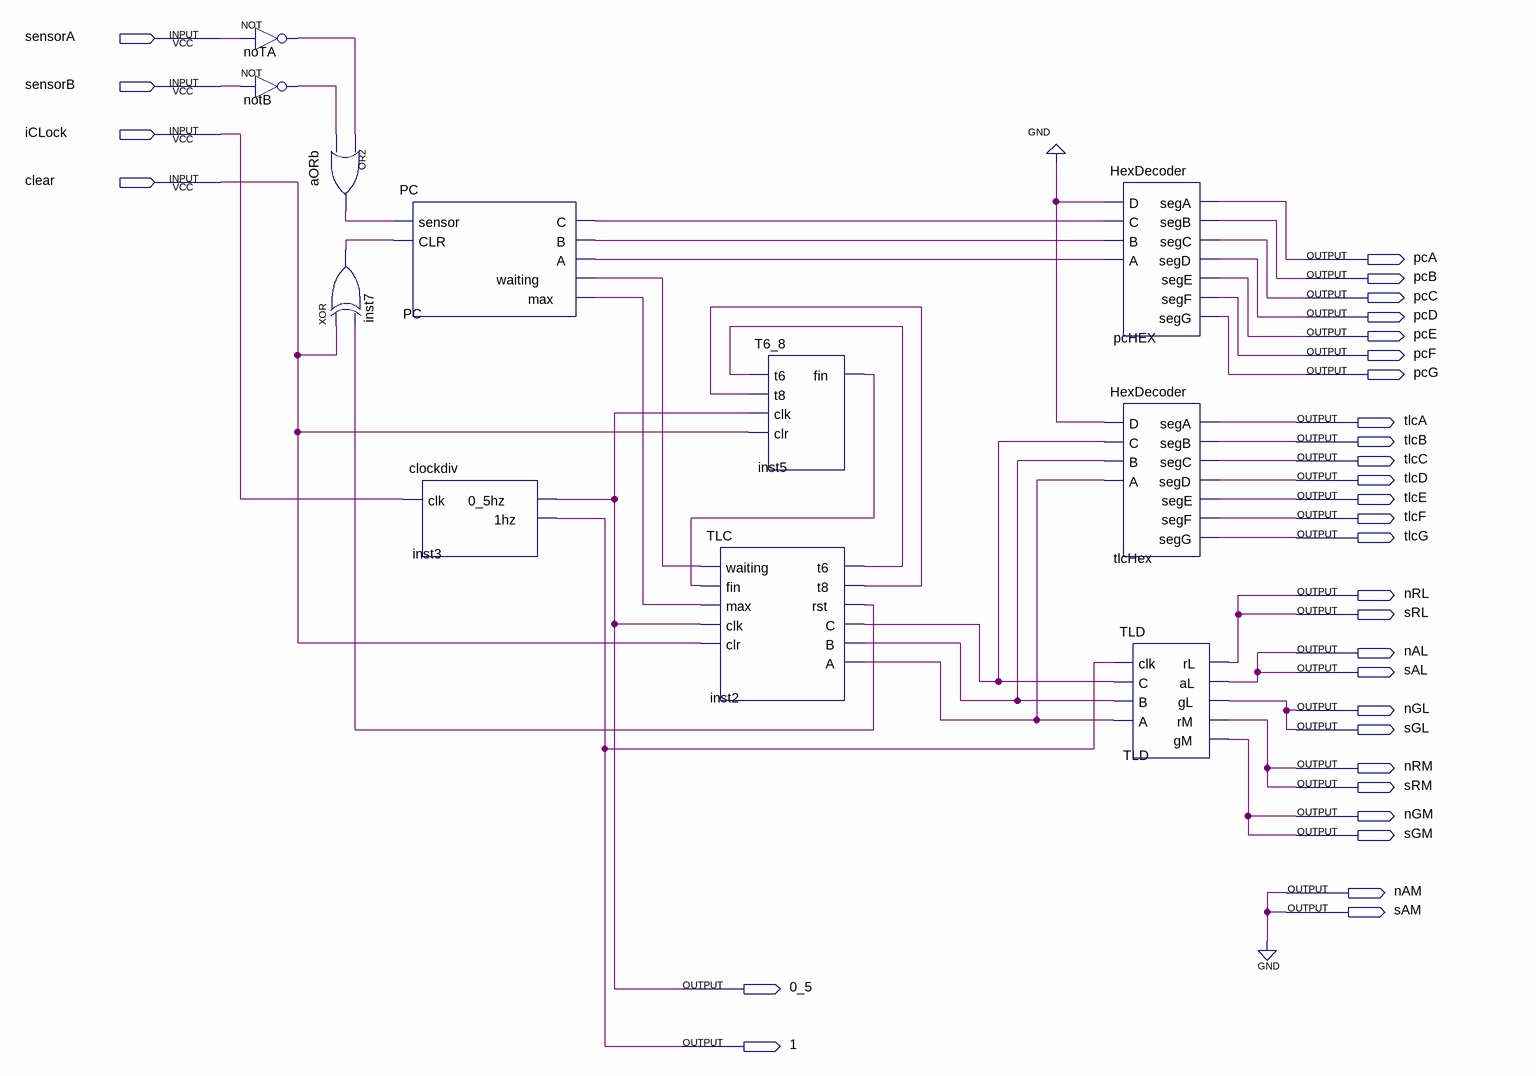
[diagram p0: schematic sheet]
// Quartus schematic master.bdf as structural Verilog: 11 symbols, 32 pins
module master (
  input  sensorA,
  input  sensorB,
  input  iCLock,
  input  clear,
  output pcA,
  output pcB,
  output pcC,
  output pcD,
  output pcE,
  output pcF,
  output pcG,
  output tlcA,
  output tlcB,
  output tlcC,
  output tlcD,
  output tlcE,
  output tlcF,
  output tlcG,
  output nRL,
  output sRL,
  output nAL,
  output sAL,
  output nGL,
  output sGL,
  output nRM,
  output sRM,
  output nGM,
  output sGM,
  output nAM,
  output sAM,
  output \0_5 ,
  output \1 
);

  wire aORb_out, inst2_a, inst2_b, inst2_c, inst2_rst, inst2_t6, inst2_t8, inst5_fin, inst7_out, noTA_out,
       notB_out, PC_a, PC_b, PC_c, PC_max, PC_waiting;

  not noTA (noTA_out, sensorA);
  not notB (notB_out, sensorB);
  or aORb (aORb_out, noTA_out, notB_out);
  xor inst7 (inst7_out, clear, inst2_rst);
  PC PC (.sensor(aORb_out), .CLR(inst7_out), .C(PC_c), .B(PC_b), .A(PC_a), .waiting(PC_waiting), .max(PC_max));
  clockdiv inst3 (.clk(iCLock), .\0_5hz (\0_5 ), .\1hz (\1 ));
  TLC inst2 (
    .waiting(PC_waiting), .fin(inst5_fin), .max(PC_max), .clk(\0_5 ), .clr(clear), .t6(inst2_t6),
    .t8(inst2_t8), .rst(inst2_rst), .C(inst2_c), .B(inst2_b), .A(inst2_a));
  T6_8 inst5 (.t6(inst2_t6), .t8(inst2_t8), .clk(\0_5 ), .clr(clear), .fin(inst5_fin));
  HexDecoder pcHEX (
    .D(1'b0), .C(PC_c), .B(PC_b), .A(PC_a), .segA(pcA), .segB(pcB), .segC(pcC), .segD(pcD), .segE(pcE),
    .segF(pcF), .segG(pcG));
  HexDecoder tlcHex (
    .D(1'b0), .C(inst2_c), .B(inst2_b), .A(inst2_a), .segA(tlcA), .segB(tlcB), .segC(tlcC), .segD(tlcD),
    .segE(tlcE), .segF(tlcF), .segG(tlcG));
  TLD TLD (.clk(\1 ), .C(inst2_c), .B(inst2_b), .A(inst2_a), .rL(nRL), .aL(nAL), .gL(nGL), .rM(nRM), .gM(nGM));

  assign nAM = 1'b0;
  assign sAL = nAL;
  assign sAM = 1'b0;
  assign sGL = nGL;
  assign sGM = nGM;
  assign sRL = nRL;
  assign sRM = nRM;
endmodule
